# EAGLE schematic misko_3_board (EAGLE 8.1.1)
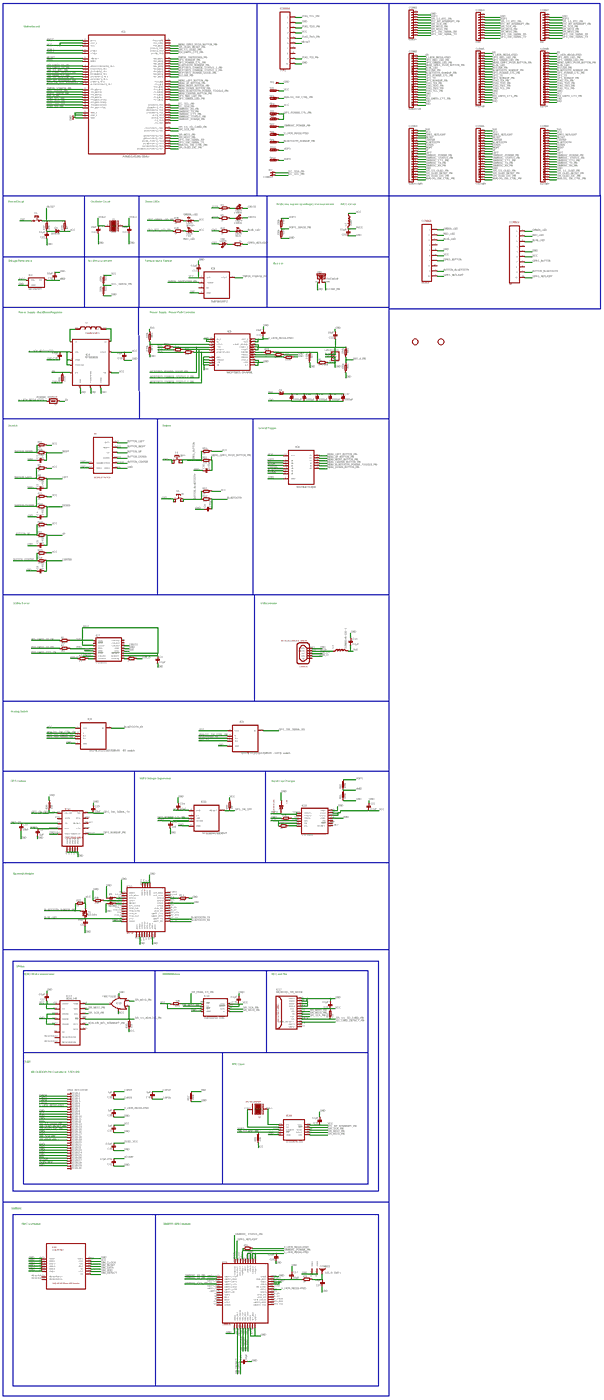
[diagram p0: schematic, sheet 1, overview]
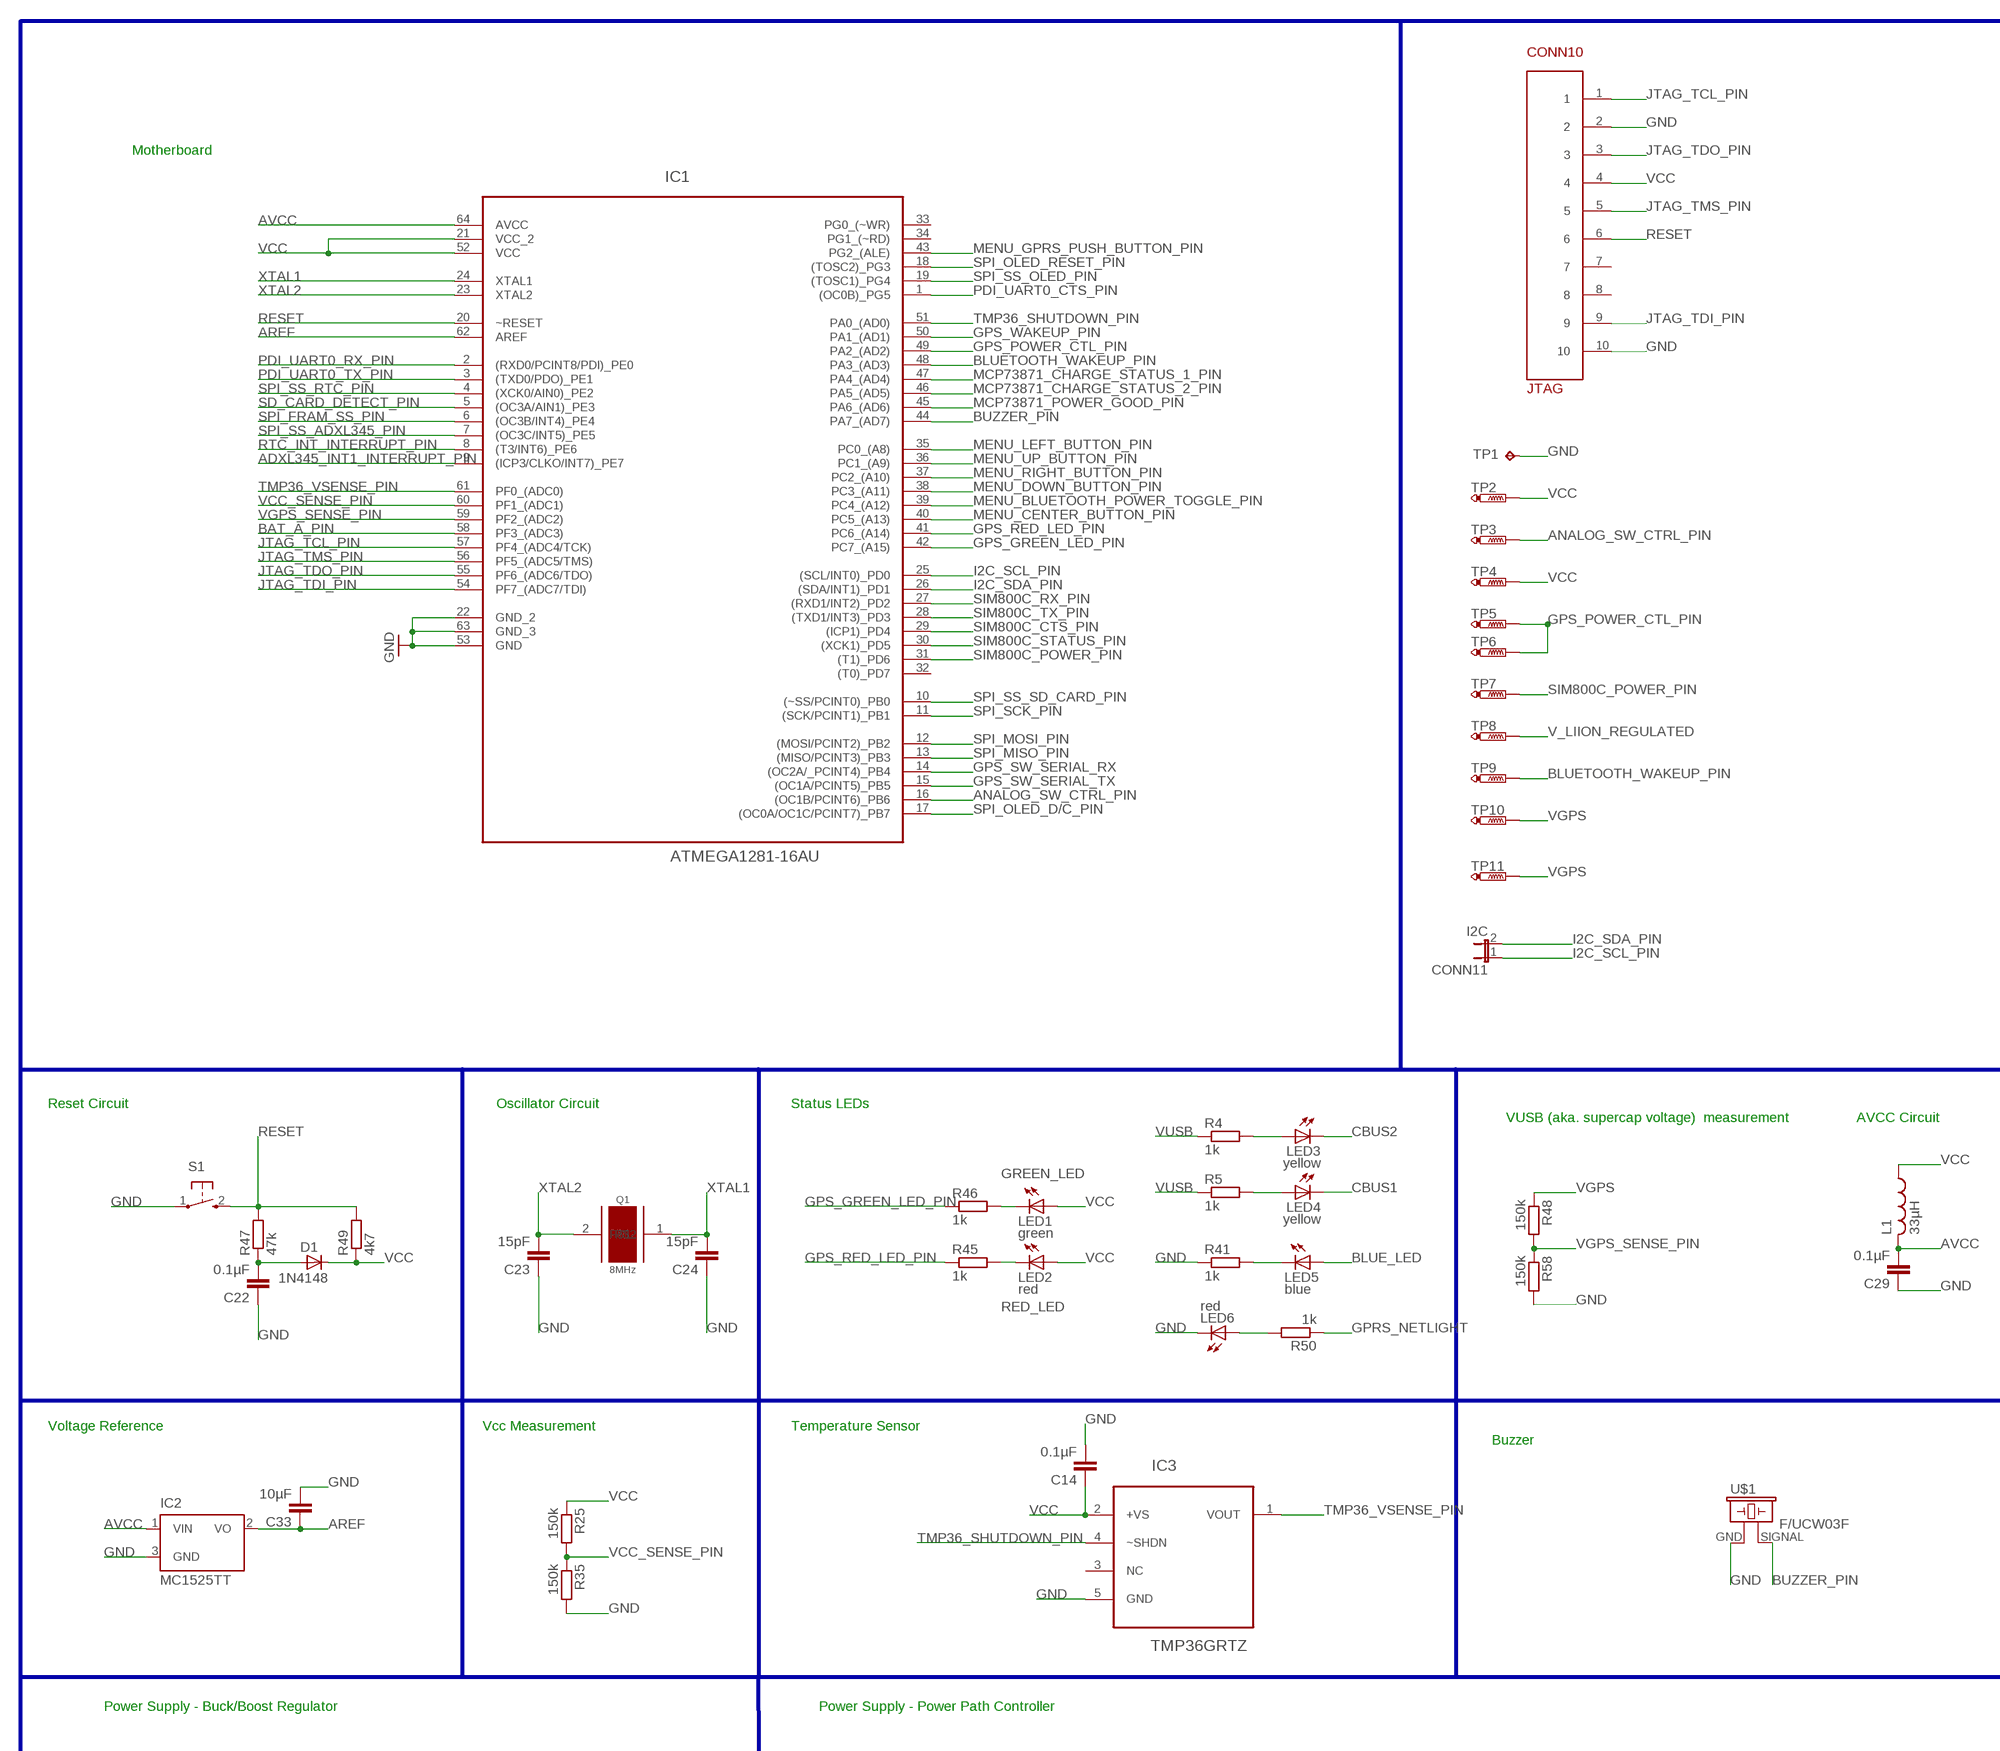
[diagram p1: schematic, sheet 1, part 1 of 5]
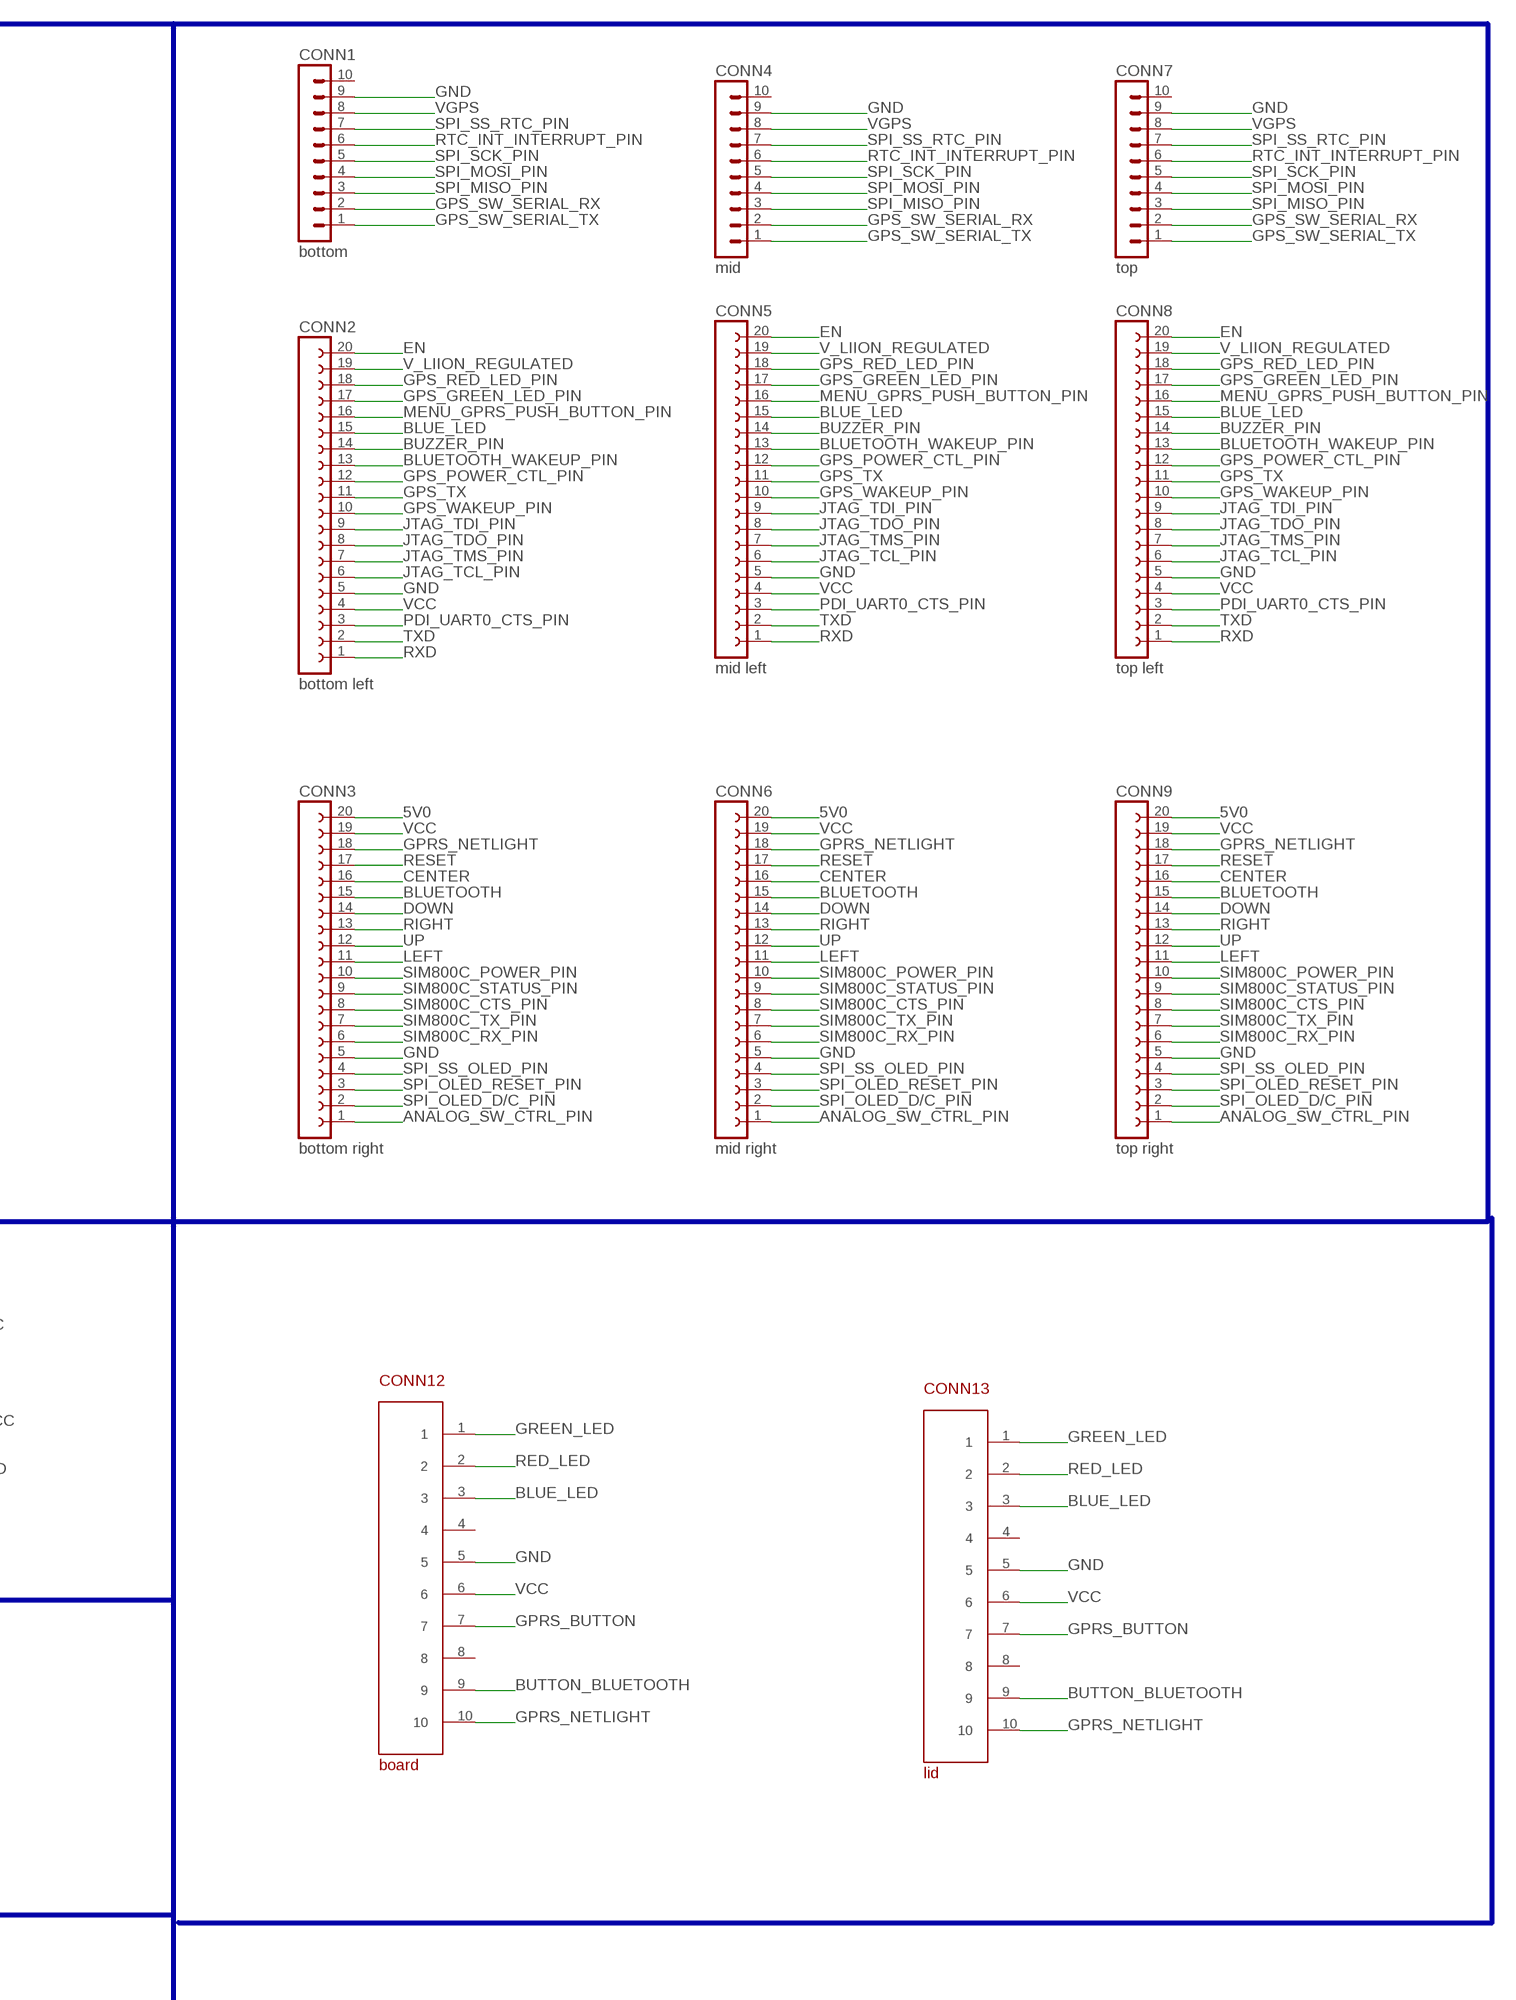
[diagram p2: schematic, sheet 1, part 2 of 5]
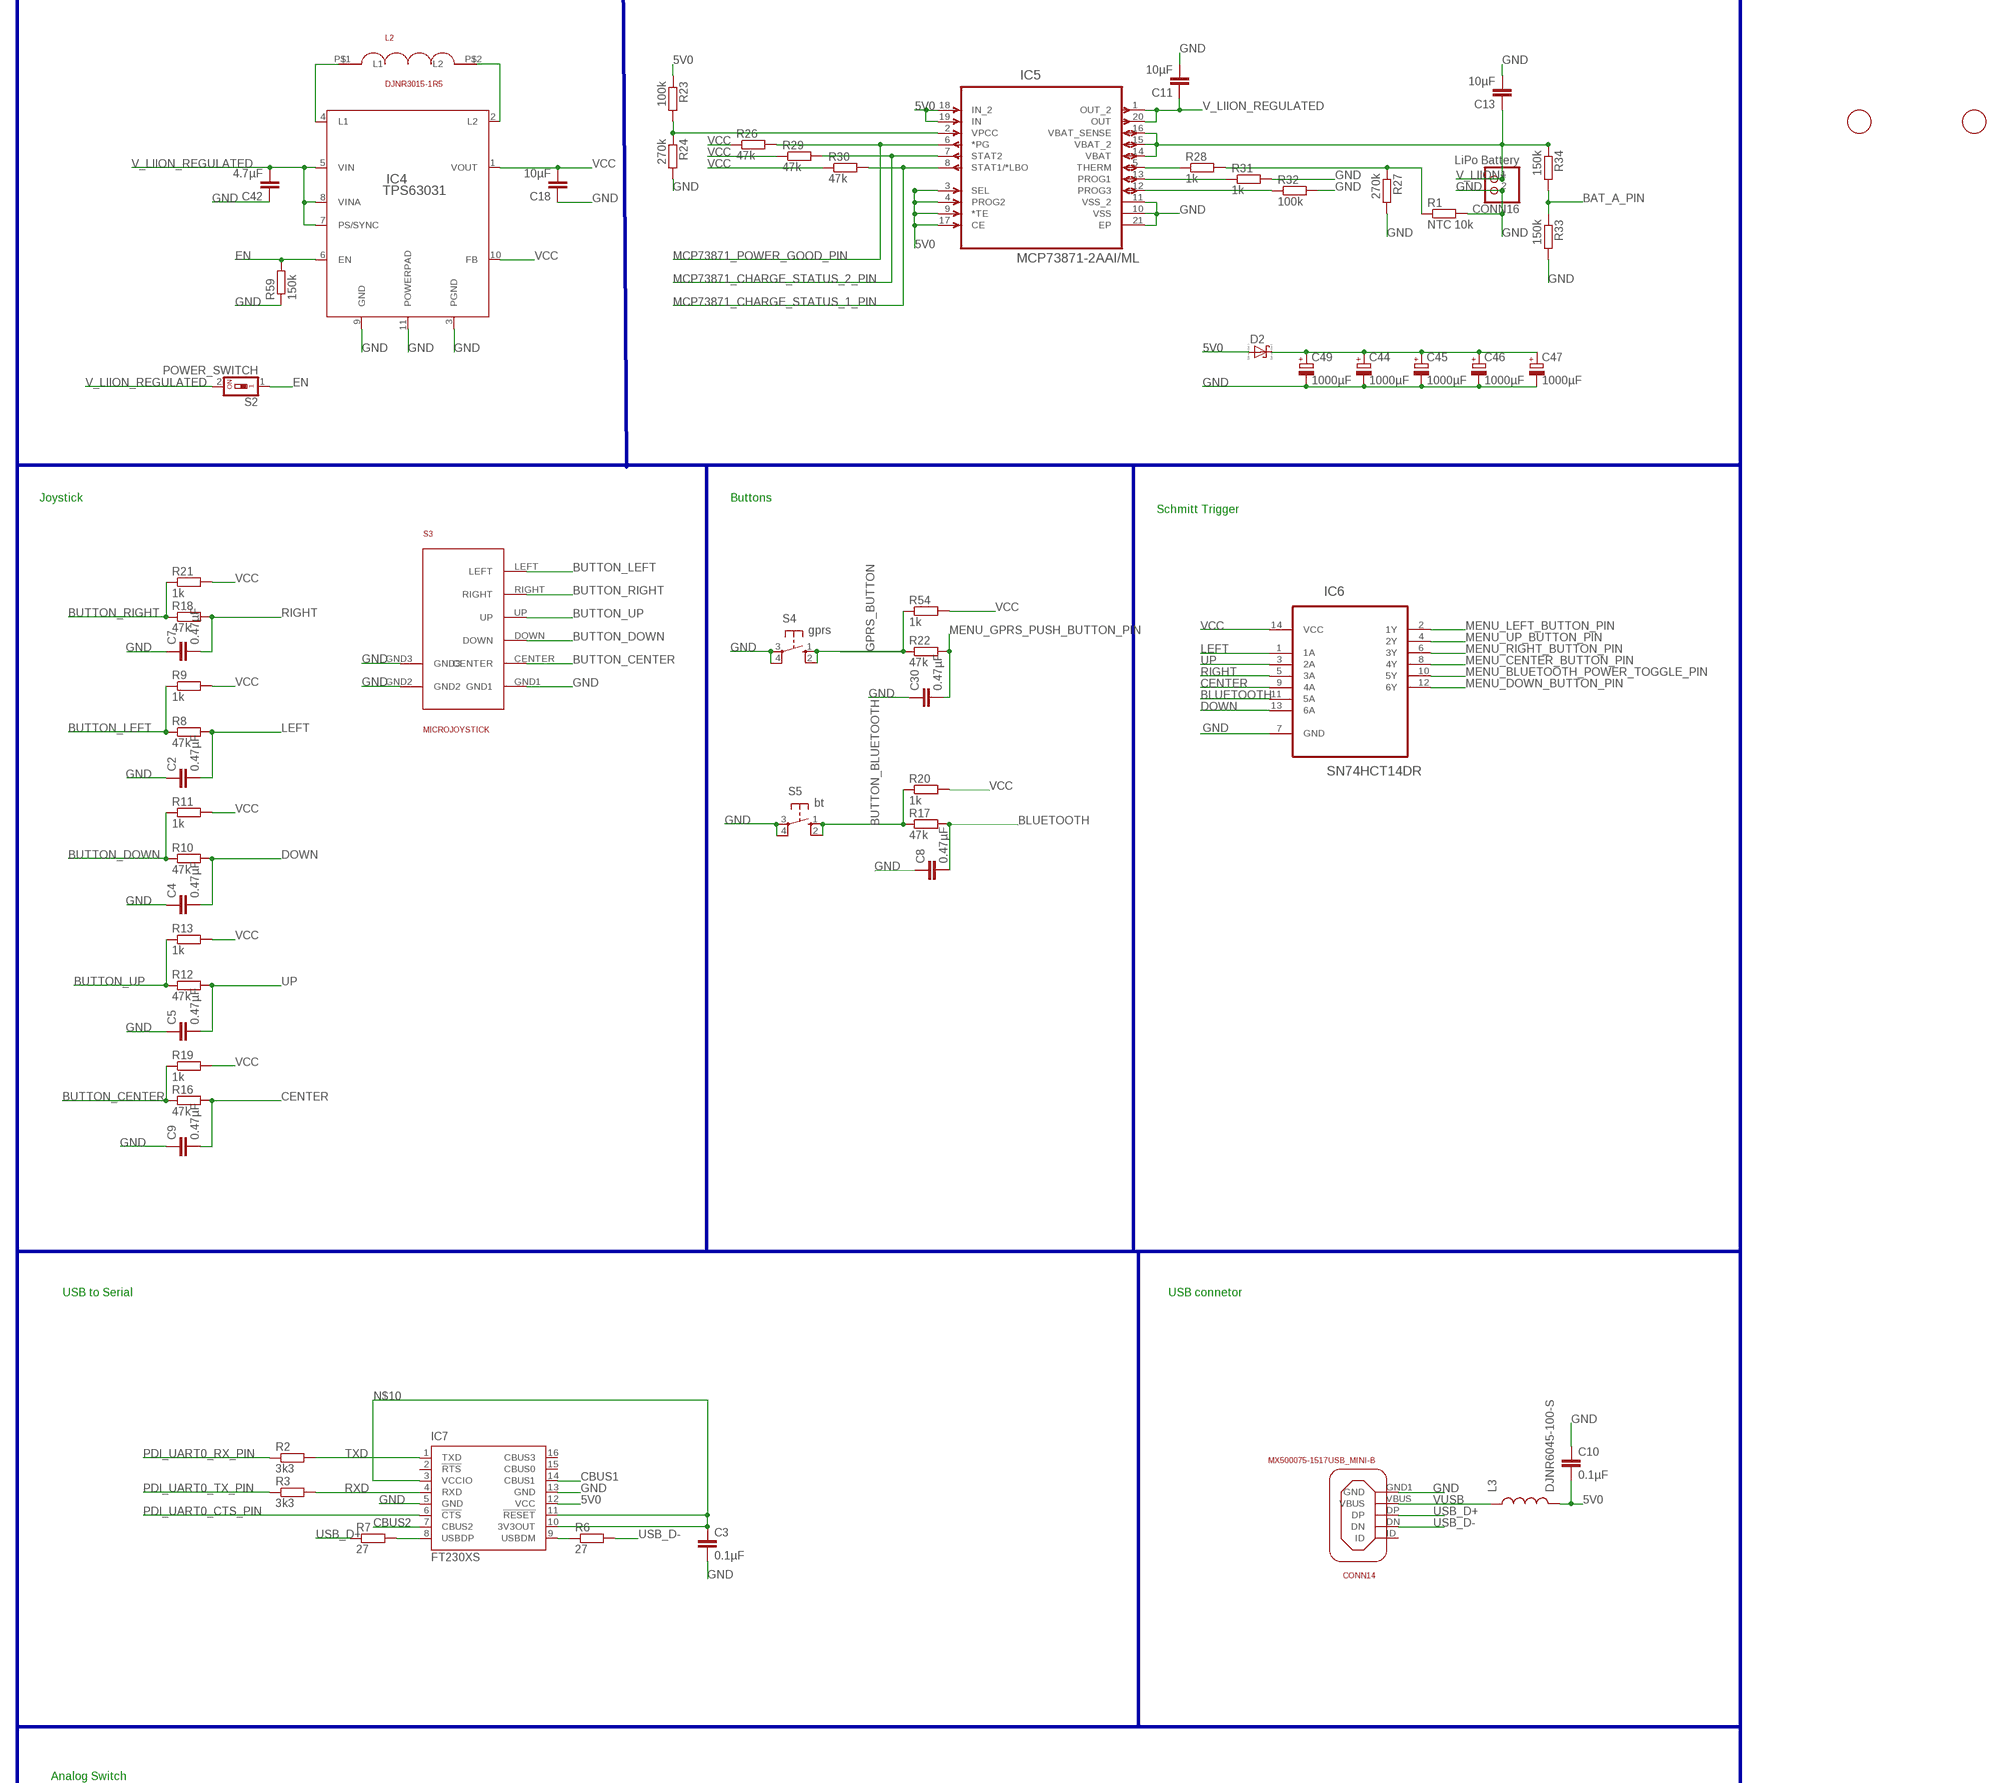
[diagram p3: schematic, sheet 1, part 3 of 5]
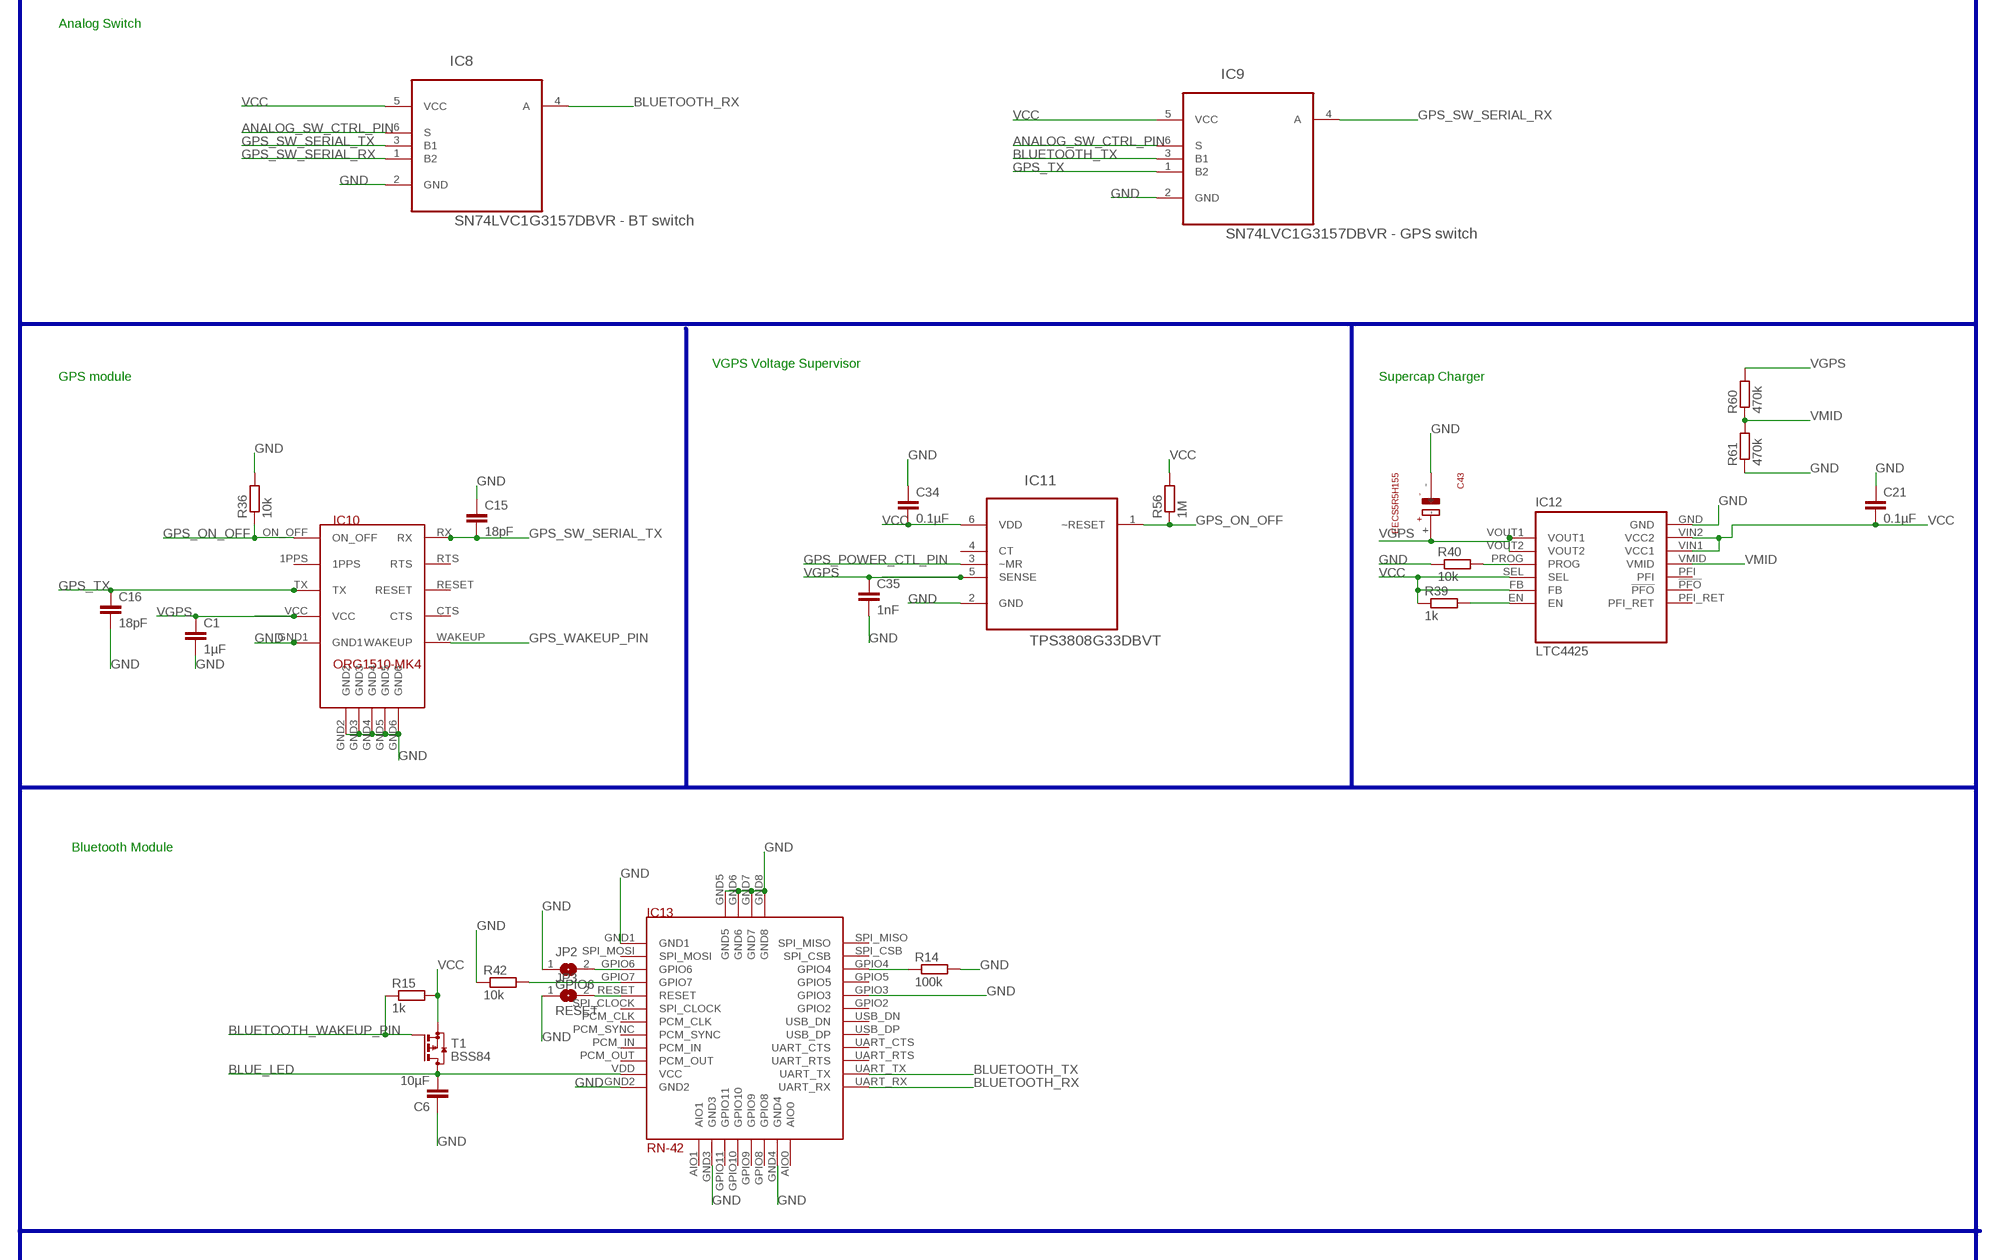
[diagram p4: schematic, sheet 1, part 4 of 5]
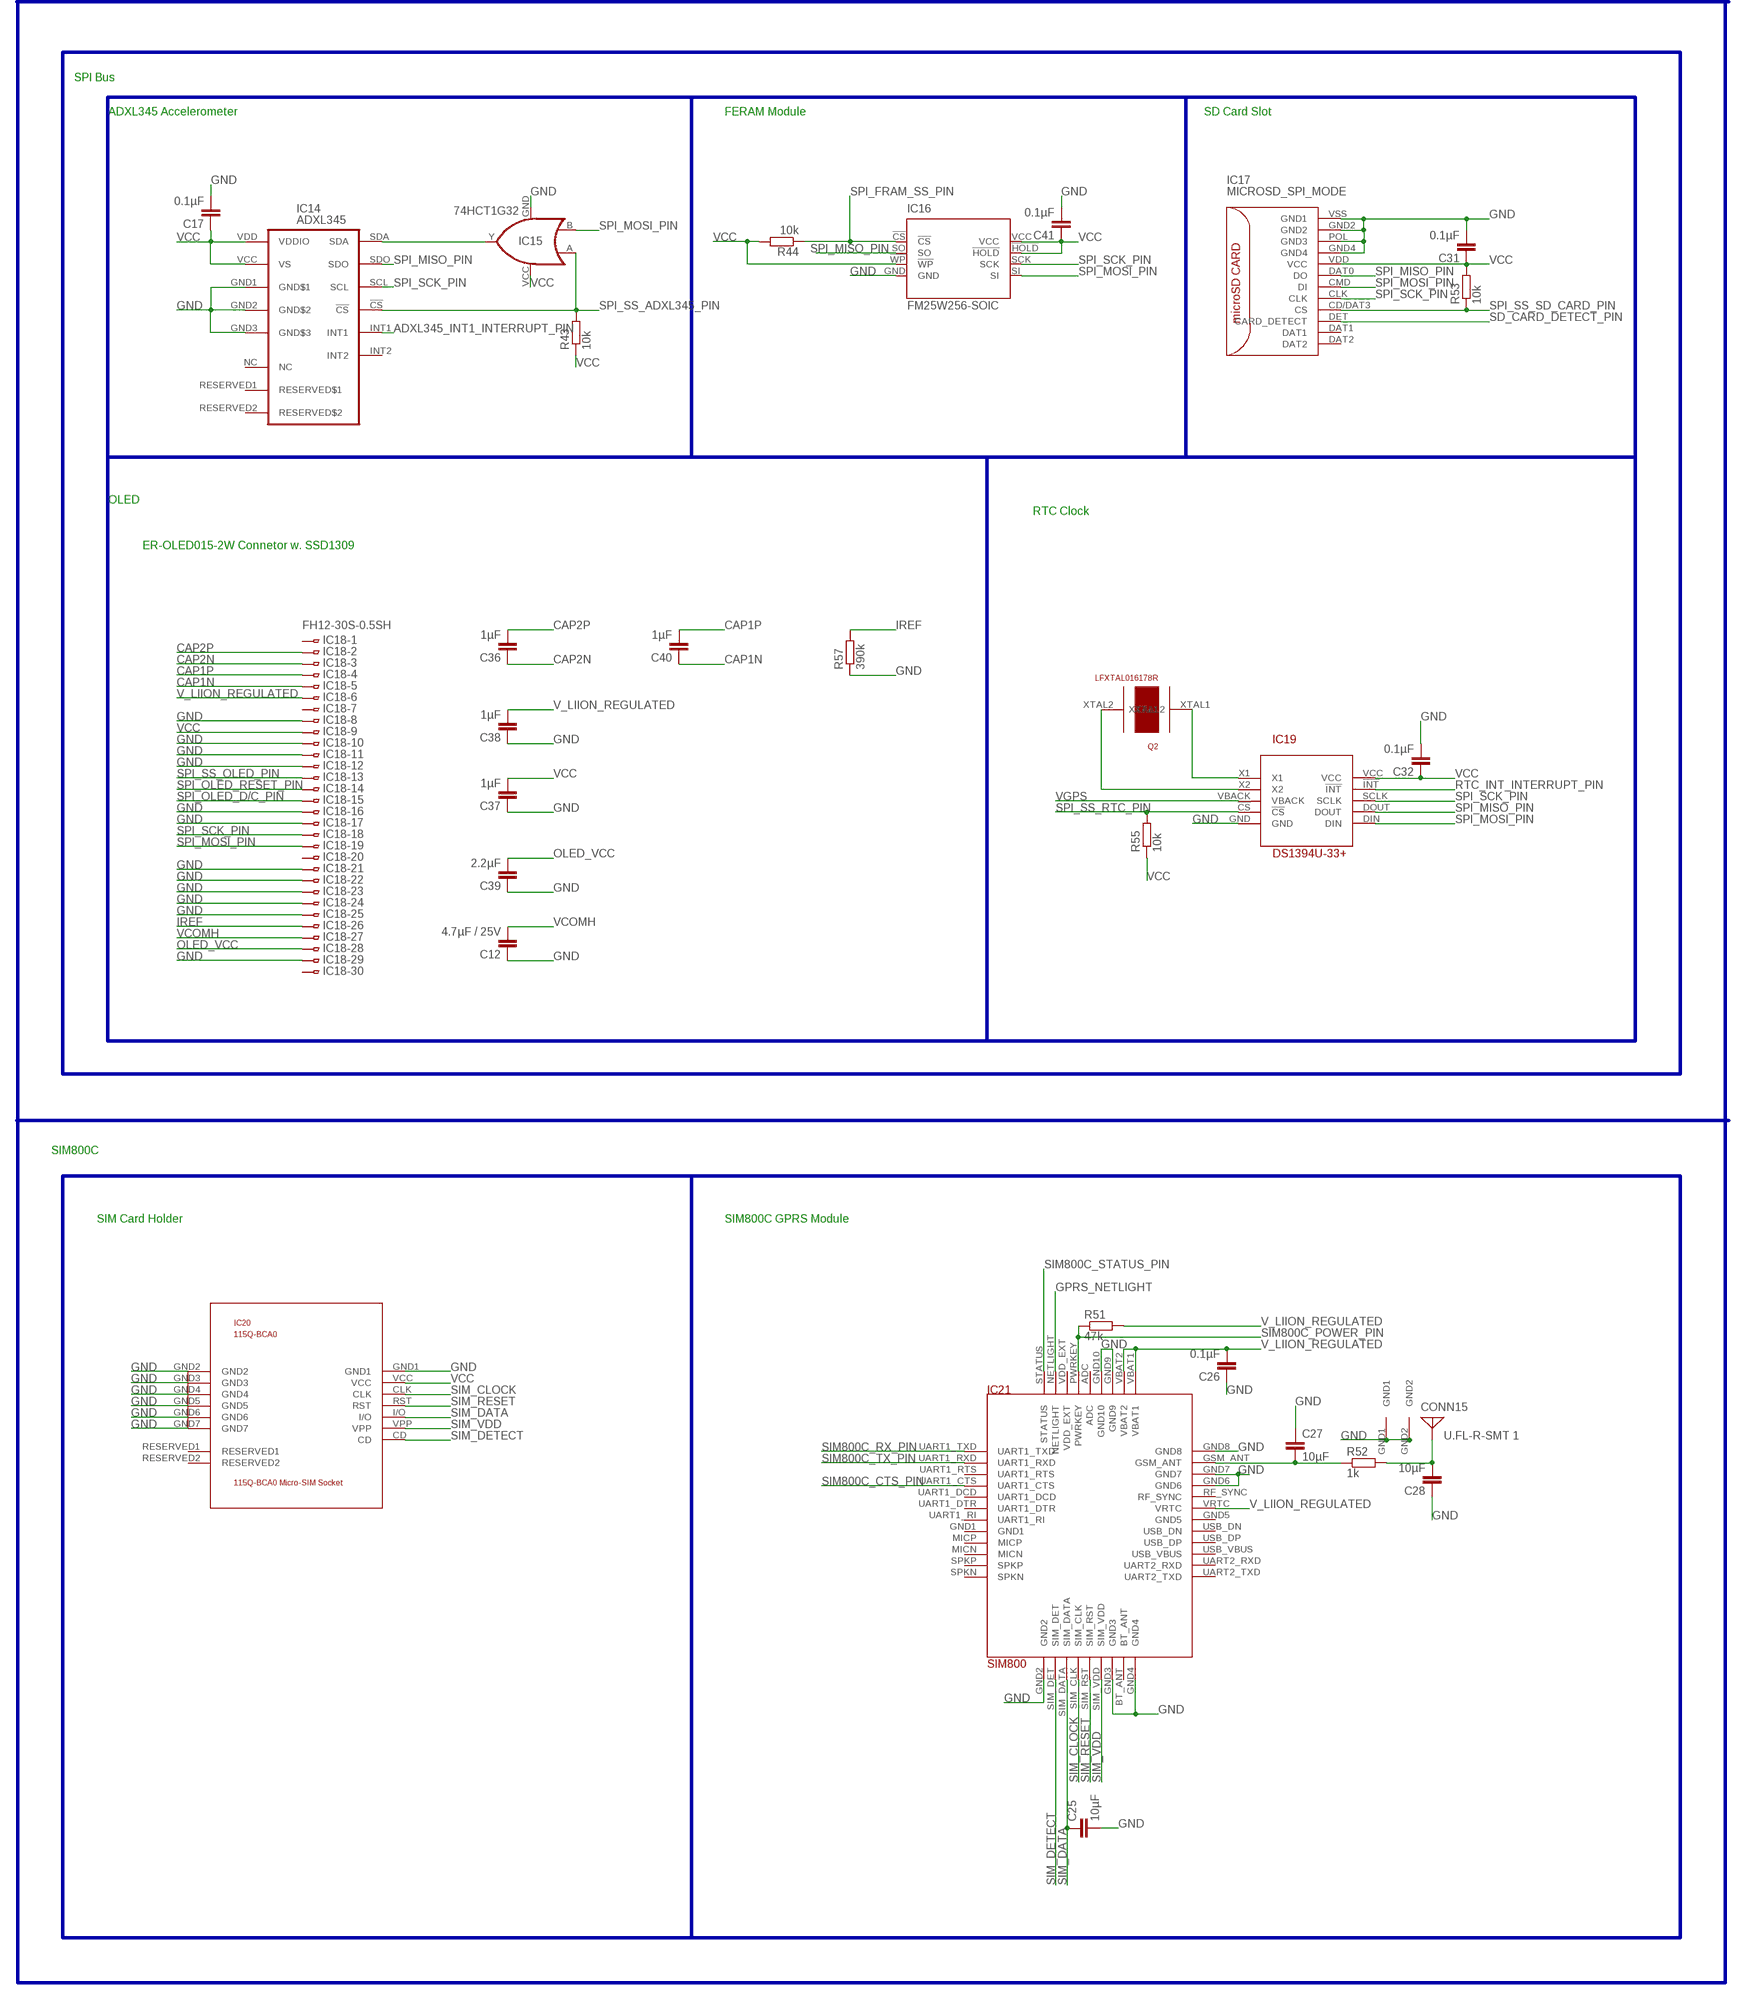
[diagram p5: schematic, sheet 1, part 5 of 5]

## Parts
C1  1µF  C-EUC0805  [C0805]
C2  0.47µF  C-EUC0805  [C0805]
C3  0.1µF  C-EUC0805  [C0805]
C4  0.47µF  C-EUC0805  [C0805]
C5  0.47µF  C-EUC0805  [C0805]
C6  10µF  C-EUC0805  [C0805]
C7  0.47µF  C-EUC0805  [C0805]
C8  0.47µF  C-EUC0805  [C0805]
C9  0.47µF  C-EUC0805  [C0805]
C10  0.1µF  C-EUC0805  [C0805]
C11  10µF  C-EUC0805  [C0805]
C12  4.7µF / 25V  C-EUC0805  [C0805]
C13  10µF  C-EUC0805  [C0805]
C14  0.1µF  C-EUC0805  [C0805]
C15  18pF  C-EUC0805  [C0805]
C16  18pF  C-EUC0805  [C0805]
C17  0.1µF  C-EUC0805  [C0805]
C18  10µF  C-EUC0805  [C0805]
C21  0.1µF  C-EUC0805  [C0805]
C22  0.1µF  C-EUC0805  [C0805]
C23  15pF  C-EUC0805  [C0805]
C24  15pF  C-EUC0805  [C0805]
C25  10µF  C-EUC0805  [C0805]
C26  0.1µF  C-EUC0805  [C0805]
C27  10µF  C-EUC0805  [C0805]
C28  10µF  C-EUC0805  [C0805]
C29  0.1µF  C-EUC0805  [C0805]
C30  0.47µF  C-EUC0805  [C0805]
C31  0.1µF  C-EUC0805  [C0805]
C32  0.1µF  C-EUC0805  [C0805]
C33  10µF  C-EUC0805  [C0805]
C34  0.1µF  C-EUC0805  [C0805]
C35  1nF  C-EUC0805  [C0805]
C36  1µF  C-EUC0805  [C0805]
C37  1µF  C-EUC0805  [C0805]
C38  1µF  C-EUC0805  [C0805]
C39  2.2µF  C-EUC0805  [C0805]
C40  1µF  C-EUC0805  [C0805]
C41  0.1µF  C-EUC0805  [C0805]
C42  4.7µF  C-EUC0805  [C0805]
C43  EECS5R5H155  [TH]
C44  1000µF  CPOL-EUE22-10AXIAL  [E22-10]
C45  1000µF  CPOL-EUE22-10AXIAL  [E22-10]
C46  1000µF  CPOL-EUE22-10AXIAL  [E22-10]
C47  1000µF  CPOL-EUE22-10AXIAL  [E22-10]
C49  1000µF  CPOL-EUE22-10AXIAL  [E22-10]
CONN1  bottom  MA10-1  [MA10-1]
CONN2  bottom left  FE20-1  [FE20]
CONN3  bottom right  FE20-1  [FE20]
CONN4  mid  MA10-1  [MA10-1]
CONN5  mid left  FE20-1  [FE20]
CONN6  mid right  FE20-1  [FE20]
CONN7  top  MA10-1  [MA10-1]
CONN8  top left  FE20-1  [FE20]
CONN9  top right  FE20-1  [FE20]
CONN10  JTAG  1.27-10-PIN-HEADER  [TH]
CONN11  I2C  JP1E  [JP1]
CONN12  board  1.27-10-PIN-HEADER  [TH]
CONN13  lid  1.27-10-PIN-HEADER  [TH]
CONN14  MX500075-1517USB_MINI-B  [TH]
CONN15  U.FL-R-SMT 1  ANTENNASMD  [SMD]
CONN16  LiPo Battery  JST_2PIN-THM-RA  [JST-PH-2-THM-RA]
D1  1N4148  [D0805]
D2  SCHOTTKY-DIODEF126Z12  [DIODE_F126Z12]
FI1  FIDUCIAL  [FIDUCIAL_1MM]
FI2  FIDUCIAL  [FIDUCIAL_1MM]
IC1  ATMEGA1281-16AU  [QFP80P1600X1600X120-64N]
IC2  MC1525TT  [SOT23]
IC3  TMP36GRTZ  TMP36GRTZ-REEL7  [SOT95P280X145-5N]
IC4  TPS63031  TPS63001DRCR  [NEWPVSON-N10]
IC5  MCP73871-2AAI/ML  [QFN50P400X400X100-21N]
IC6  SN74HCT14DR  [SOIC127P600X175-14N]
IC7  FT230XS  [SSOP16]
IC8  SN74LVC1G3157DBVR - BT switch  SN74LVC1G3157DBVR  [SOT95P280X145-6N]
IC9  SN74LVC1G3157DBVR - GPS switch  SN74LVC1G3157DBVR  [SOT95P280X145-6N]
IC10  ORG1510-MK4  [PACKAGE]
IC11  TPS3808G33DBVT  [SOT95P280X145-6N]
IC12  LTC4425  [MSOP]
IC13  RN-42  [RN-42]
IC14  ADXL345  [LGA14]
IC15  74HCT1G32  74HCT1G32GW-DC  [SOT353/5]
IC16  FM25W256-SOIC  [SOIC08]
IC17  MICROSD_SPI_MODE  [MICRO_SD_CONNECTOR]
IC18  FH12-30S-0.5SH  [FH12-30S-0.5SH]
IC19  DS1394U-33+  [10UMAX]
IC20  115Q-BCA0  [115Q-BCA0]
IC21  SIM800  [SIM800C]
JP2  GPIO6  SJW  [SJW]
JP3  RESET  SJW  [SJW]
L1  33µH  L-US  [L0805]
L2  DJNR3015-1R5  [FFF]
L3  DJNR6045-100-S  [DJNR6045-100-S]
LED1  green  LEDSQR2X5  [LED2X5]
LED2  red  LEDSQR2X5  [LED2X5]
LED3  yellow  LEDCHIPLED_1206  [CHIPLED_1206]
LED4  yellow  LEDCHIPLED_1206  [CHIPLED_1206]
LED5  blue  LEDSQR2X5  [LED2X5]
LED6  red  LEDSQR2X5  [LED2X5]
Q1  8MHz  OSCILATOR  [QS]
Q2  LFXTAL016178R  [SMD]
R1  NTC 10k  R-EU_0204/5  [0204/5]
R2  3k3  R-EU_R0805  [R0805]
R3  3k3  R-EU_R0805  [R0805]
R4  1k  R-EU_R0805  [R0805]
R5  1k  R-EU_R0805  [R0805]
R6  27  R-EU_R0805  [R0805]
R7  27  R-EU_R0805  [R0805]
R8  47k  R-EU_R0805  [R0805]
R9  1k  R-EU_R0805  [R0805]
R10  47k  R-EU_R0805  [R0805]
R11  1k  R-EU_R0805  [R0805]
R12  47k  R-EU_R0805  [R0805]
R13  1k  R-EU_R0805  [R0805]
R14  100k  R-EU_R0805  [R0805]
R15  1k  R-EU_R0805  [R0805]
R16  47k  R-EU_R0805  [R0805]
R17  47k  R-EU_R0805  [R0805]
R18  47k  R-EU_R0805  [R0805]
R19  1k  R-EU_R0805  [R0805]
R20  1k  R-EU_R0805  [R0805]
R21  1k  R-EU_R0805  [R0805]
R22  47k  R-EU_R0805  [R0805]
R23  100k  R-EU_R0805  [R0805]
R24  270k  R-EU_R0805  [R0805]
R25  150k  R-EU_R0805  [R0805]
R26  47k  R-EU_R0805  [R0805]
R27  270k  R-EU_R0805  [R0805]
R28  1k  R-EU_R0805  [R0805]
R29  47k  R-EU_R0805  [R0805]
R30  47k  R-EU_R0805  [R0805]
R31  1k  R-EU_R0805  [R0805]
R32  100k  R-EU_R0805  [R0805]
R33  150k  R-EU_R0805  [R0805]
R34  150k  R-EU_R0805  [R0805]
R35  150k  R-EU_R0805  [R0805]
R36  10k  R-EU_R0805  [R0805]
R39  1k  R-EU_R0805  [R0805]
R40  10k  R-EU_R0805  [R0805]
R41  1k  R-EU_R0805  [R0805]
R42  10k  R-EU_R0805  [R0805]
R43  10k  R-EU_R0805  [R0805]
R44  10k  R-EU_R0805  [R0805]
R45  1k  R-EU_R0805  [R0805]
R46  1k  R-EU_R0805  [R0805]
R47  47k  R-EU_R0805  [R0805]
R48  150k  R-EU_R0805  [R0805]
R49  4k7  R-EU_R0805  [R0805]
R50  1k  R-EU_R0805  [R0805]
R51  47k  R-EU_R0805  [R0805]
R52  1k  R-EU_R0805  [R0805]
R53  10k  R-EU_R0805  [R0805]
R54  1k  R-EU_R0805  [R0805]
R55  10k  R-EU_R0805  [R0805]
R56  1M  R-EU_R0805  [R0805]
R57  390k  R-EU_R0805  [R0805]
R58  150k  R-EU_R0805  [R0805]
R59  150k  R-EU_R0805  [R0805]
R60  470k  R-EU_R0805  [R0805]
R61  470k  R-EU_R0805  [R0805]
S1  DTSM-32N-B  [DTSM-32N-B]
S2  POWER_SWITCH  SWS001  [SMS-001]
S3  MICROJOYSTICK  [MICROJOYSTICK]
S4  gprs  10-XX  [B3F-10XX]
S5  bt  10-XX  [B3F-10XX]
T1  BSS84  [SOT23]
TP1  GND  TPPAD1-17Y  [P1-17Y]
TP2  VCC  PTR1TP14R  [TP14R]
TP3  Analogue Switch CRTL Pin  PTR1TP14R  [TP14R]
TP4  VCC  PTR1TP14R  [TP14R]
TP5  GPS Power CTRL Pin  PTR1B1,27  [B1,27]
TP6  GPS Power CTRL Pin  PTR1B1,27  [B1,27]
TP7  SIM800 Power CTRL Pin  PTR1B1,27  [B1,27]
TP8  VLiIon Regulated  PTR1TP14R  [TP14R]
TP9  Bluetooth Wakeup Pin  PTR1TP14R  [TP14R]
TP10  VGPS  PTR1TP14R  [TP14R]
TP11  VGPS  PTR1TP14R  [TP14R]
U$1  F/UCW03F  [F/UCW03LF]

## Nets
5V0 [VCC]: C10.2 CONN3.20 CONN6.20 CONN9.20 D2.A(C) IC5.3(SEL) IC5.4(PROG2) IC5.9(*TE) IC5.17(CE) IC5.18(IN_2) IC5.19(IN) IC7.12(VCC) L3.P$2 R23.1
ADXL345_INT1_INTERRUPT_PIN [signal]: IC1.9((ICP3/CLKO/INT7)_PE7) IC14.INT1
ADXL345SDA [signal]: IC14.SDA IC15.Y
ANALOG_SW_CTRL_PIN [signal cross-board]: CONN3.1 CONN6.1 CONN9.1 IC1.16((OC1B/PCINT6)_PB6) IC8.6(S) IC9.6(S) TP3.TP
ANTENNA [signal]: C28.2 CONN15.SIGNAL(ANT) R52.2
AREF [signal]: C33.1 IC1.62(AREF) IC2.2(VO)
AVCC [signal]: C29.2 IC1.64(AVCC) IC2.1(VIN) L1.2
BAT_A_PIN [signal]: IC1.58(PF3_(ADC3)) R33.1 R34.2
BLUE_LED [signal cross-board]: C6.2 CONN2.15 CONN5.15 CONN8.15 CONN12.3 CONN13.3 IC13.VDD(VCC) LED5.A T1.3(D)
BLUETOOTH [signal cross-board]: C8.2 CONN3.15 CONN6.15 CONN9.15 IC6.11(5A) R17.2
BLUETOOTH_RX [signal]: IC8.4(A) IC13.UART_RX
BLUETOOTH_TX [signal]: IC9.3(B1) IC13.UART_TX
BLUETOOTH_WAKEUP_PIN [signal cross-board]: CONN2.13 CONN5.13 CONN8.13 IC1.48(PA3_(AD3)) R15.1 T1.1(G) TP9.TP
BT_GPIO6 [signal]: IC13.GPIO6 JP2.2
BT_LED [signal]: LED5.K(C) R41.2
BT_RST [signal]: IC13.RESET JP3.2
BUTTON_BLUETOOTH [signal cross-board]: CONN12.9 CONN13.9 R17.1 R20.1 S5.1(S) S5.2(S1)
BUTTON_CENTER [signal]: R16.1 R19.1 S3.CENTER
BUTTON_DOWN [signal]: R10.1 R11.1 S3.DOWN
BUTTON_LEFT [signal]: R8.1 R9.1 S3.LEFT
BUTTON_RIGHT [signal]: R18.1 R21.1 S3.RIGHT
BUTTON_UP [signal]: R12.1 R13.1 S3.UP
BUZZER_PIN [signal cross-board]: CONN2.14 CONN5.14 CONN8.14 IC1.44(PA7_(AD7)) U$1.SIGNAL
CAP1N [signal]: C40.1 IC18.5
CAP1P [signal]: C40.2 IC18.4
CAP2N [signal]: C36.1 IC18.3
CAP2P [signal]: C36.2 IC18.2
CBUS1 [signal]: IC7.14(CBUS1) LED4.C
CBUS2 [signal]: IC7.7(CBUS2) LED3.C
CENTER [signal cross-board]: C9.2 CONN3.16 CONN6.16 CONN9.16 IC6.9(4A) R16.2
DOWN [signal cross-board]: C4.2 CONN3.14 CONN6.14 CONN9.14 IC6.13(6A) R10.2
EN [signal cross-board]: CONN2.20 CONN5.20 CONN8.20 IC4.6(EN) R59.2 S2.1
GND: C1.2 C2.1 C3.2 C4.1 C5.1 C6.1 C7.1 C8.1 C9.1 C10.1 C11.2 C12.1 C13.2 C14.2 C15.1 C16.2 C17.2 C18.1 C21.1 C22.1 C23.1 C24.1 C25.2 C26.1 C27.1 C28.1 C29.1 C30.1 C31.2 C32.2 C33.2 C34.1 C35.2 C37.1 C38.1 C39.1 C41.2 C42.1 C43.- C44.- C45.- C46.- C47.- C49.- CONN1.9 CONN2.5 CONN3.5 CONN4.9 CONN5.5 CONN6.5 CONN7.9 CONN8.5 CONN9.5 CONN10.2 CONN10.10 CONN12.5 CONN13.5 CONN14.GND1(GND) CONN15.GND1 CONN15.GND2 CONN16.2 IC1.22(GND_2) IC1.53(GND) IC1.63(GND_3) IC2.3(GND) IC3.5(GND) IC4.3(PGND) IC4.9(GND) IC4.11(POWERPAD) IC5.10(VSS) IC5.11(VSS_2) IC5.21(EP) IC6.7(GND) IC7.5(GND) IC7.13(GND) IC8.2(GND) IC9.2(GND) IC10.GND1 IC10.GND2 IC10.GND3 IC10.GND4 IC10.GND5 IC10.GND6 IC11.2(GND) IC12.GND IC13.GND1 IC13.GND2 IC13.GND3 IC13.GND4 IC13.GND5 IC13.GND6 IC13.GND7 IC13.GND8 IC13.GPIO3 IC14.GND1(GND$1) IC14.GND2(GND$2) IC14.GND3(GND$3) IC15.GND IC16.GND IC17.GND2 IC17.GND4 IC17.POL(GND3) IC17.VSS(GND1) IC18.8 IC18.10 IC18.11 IC18.12 IC18.16 IC18.17 IC18.21 IC18.22 IC18.23 IC18.24 IC18.25 IC18.29 IC19.GND IC20.GND1 IC20.GND2 IC20.GND3 IC20.GND4 IC20.GND5 IC20.GND6 IC20.GND7 IC21.GND2 IC21.GND3 IC21.GND4 IC21.GND6 IC21.GND7 IC21.GND8 IC21.GND9 IC21.GND10 JP2.1 JP3.1 LED6.K(C) R1.2 R14.2 R24.2 R27.2 R31.2 R32.2 R33.2 R35.2 R36.2 R40.1 R41.1 R42.1 R57.1 R58.2 R59.1 R61.1 S1.1 S3.GND1 S3.GND2 S3.GND3 S4.3(P) S4.4(P1) S5.3(P) S5.4(P1) TP1.TP U$1.GND
GPIO4 [signal]: IC13.GPIO4 R14.1
GPIO7 [signal]: IC13.GPIO7 R42.2
GPRS_BUTTON [signal cross-board]: CONN12.7 CONN13.7 R22.1 R54.1 S4.1(S) S4.2(S1)
GPRS_LED [signal]: LED6.A R50.2
GPRS_NETLIGHT [signal cross-board]: CONN3.18 CONN6.18 CONN9.18 CONN12.10 CONN13.10 IC21.NETLIGHT R50.1
GPS_GREEN_LED_PIN [signal cross-board]: CONN2.17 CONN5.17 CONN8.17 IC1.42(PC7_(A15)) R46.1
GPS_ON_OFF [signal cross-board]: IC10.ON_OFF IC11.1(~RESET) R36.1 R56.1
GPS_POWER_CTL_PIN [signal]: CONN2.12 CONN5.12 CONN8.12 IC1.49(PA2_(AD2)) IC11.3(~MR) TP5.TP TP6.TP
GPS_RED_LED_PIN [signal cross-board]: CONN2.18 CONN5.18 CONN8.18 IC1.41(PC6_(A14)) R45.1
GPS_SW_SERIAL_RX [signal cross-board]: CONN1.2 CONN4.2 CONN7.2 IC1.14((OC2A/_PCINT4)_PB4) IC8.1(B2) IC9.4(A)
GPS_SW_SERIAL_TX [signal cross-board]: C15.2 CONN1.1 CONN4.1 CONN7.1 IC1.15((OC1A/PCINT5)_PB5) IC8.3(B1) IC10.RX
GPS_TX [signal cross-board]: C16.1 CONN2.11 CONN5.11 CONN8.11 IC9.1(B2) IC10.TX
GPS_WAKEUP_PIN [signal cross-board]: CONN2.10 CONN5.10 CONN8.10 IC1.50(PA1_(AD1)) IC10.WAKEUP
GREEN_LED [signal cross-board]: CONN12.1 CONN13.1 LED1.K(C) R46.2
GSM_ANT [signal]: C27.2 IC21.GSM_ANT R52.1
I2C_SCL_PIN [signal]: CONN11.1 IC1.25((SCL/INT0)_PD0)
I2C_SDA_PIN [signal]: CONN11.2 IC1.26((SDA/INT1)_PD1)
IREF [signal]: IC18.26 R57.2
JTAG_TCL_PIN [signal cross-board]: CONN2.6 CONN5.6 CONN8.6 CONN10.1 IC1.57(PF4_(ADC4/TCK))
JTAG_TDI_PIN [signal cross-board]: CONN2.9 CONN5.9 CONN8.9 CONN10.9 IC1.54(PF7_(ADC7/TDI))
JTAG_TDO_PIN [signal cross-board]: CONN2.8 CONN5.8 CONN8.8 CONN10.3 IC1.55(PF6_(ADC6/TDO))
JTAG_TMS_PIN [signal cross-board]: CONN2.7 CONN5.7 CONN8.7 CONN10.5 IC1.56(PF5_(ADC5/TMS))
L1 [signal]: IC4.4(L1) L2.P$1(L1)
L2 [signal]: IC4.2(L2) L2.P$2(L2)
LEFT [signal cross-board]: C2.2 CONN3.11 CONN6.11 CONN9.11 IC6.1(1A) R8.2
LTC4425_EN [signal]: IC12.EN R39.2
LTC4425_PROG [signal]: IC12.PROG R40.2
MCP73871_CHARGE_STATUS_1_PIN [signal]: IC1.47(PA4_(AD4)) IC5.8(STAT1/*LBO) R30.2
MCP73871_CHARGE_STATUS_2_PIN [signal]: IC1.46(PA5_(AD5)) IC5.7(STAT2) R29.2
MCP73871_POWER_GOOD_PIN [signal]: IC1.45(PA6_(AD6)) IC5.6(*PG) R26.2
MENU_BLUETOOTH_POWER_TOGGLE_PIN [signal]: IC1.39(PC4_(A12)) IC6.10(5Y)
MENU_CENTER_BUTTON_PIN [signal]: IC1.40(PC5_(A13)) IC6.8(4Y)
MENU_DOWN_BUTTON_PIN [signal]: IC1.38(PC3_(A11)) IC6.12(6Y)
MENU_GPRS_PUSH_BUTTON_PIN [signal cross-board]: C30.2 CONN2.16 CONN5.16 CONN8.16 IC1.43(PG2_(ALE)) R22.2
MENU_LEFT_BUTTON_PIN [signal]: IC1.35(PC0_(A8)) IC6.2(1Y)
MENU_RIGHT_BUTTON_PIN [signal]: IC1.37(PC2_(A10)) IC6.6(3Y)
MENU_UP_BUTTON_PIN [signal]: IC1.36(PC1_(A9)) IC6.4(2Y)
N$6: C44.+ C45.+ C46.+ C47.+ C49.+ D2.C(A)
N$10 [signal]: C3.1 IC7.3(VCCIO) IC7.10(3V3OUT) IC7.11(!RESET)
N$19 [signal]: R1.1 R27.1 R28.2
N$31 [signal]: C22.2 D1.A R47.1
OLED_VCC [signal]: C39.2 IC18.28
PDI_UART0_CTS_PIN [signal cross-board]: CONN2.3 CONN5.3 CONN8.3 IC1.1((OC0B)_PG5) IC7.6(!CTS)
PDI_UART0_RX_PIN [signal cross-board]: IC1.2((RXD0/PCINT8/PDI)_PE0) R2.1
PDI_UART0_TX_PIN [signal cross-board]: IC1.3((TXD0/PDO)_PE1) R3.1
PROG1 [signal]: IC5.13(PROG1) R31.1
PROG3 [signal]: IC5.12(PROG3) R32.1
RED_LED [signal cross-board]: CONN12.2 CONN13.2 LED2.K(C) R45.2
RESET [signal cross-board]: CONN3.17 CONN6.17 CONN9.17 CONN10.6 IC1.20(~RESET) R47.2 R49.2 S1.2
RIGHT [signal cross-board]: C7.2 CONN3.13 CONN6.13 CONN9.13 IC6.5(3A) R18.2
RTC_INT_INTERRUPT_PIN [signal cross-board]: CONN1.6 CONN4.6 CONN7.6 IC1.8((T3/INT6)_PE6) IC19.!INT!
RTC_XTAL1 [signal]: IC19.X1 Q2.XTAL1
RTC_XTAL2 [signal]: IC19.X2 Q2.XTAL2
RXD [signal cross-board]: CONN2.1 CONN5.1 CONN8.1 IC7.4(RXD) R3.2
SD_CARD_DETECT_PIN [signal]: IC1.5((OC3A/AIN1)_PE3) IC17.DET(CARD_DETECT)
SIM800C_CTS_PIN [signal cross-board]: CONN3.8 CONN6.8 CONN9.8 IC1.29((ICP1)_PD4) IC21.UART1_CTS
SIM800C_POWER_PIN [signal cross-board]: CONN3.10 CONN6.10 CONN9.10 IC1.31((T1)_PD6) IC21.PWRKEY R51.1 TP7.TP
SIM800C_RX_PIN [signal cross-board]: CONN3.6 CONN6.6 CONN9.6 IC1.27((RXD1/INT2)_PD2) IC21.UART1_TXD
SIM800C_STATUS_PIN [signal cross-board]: CONN3.9 CONN6.9 CONN9.9 IC1.30((XCK1)_PD5) IC21.STATUS
SIM800C_TX_PIN [signal cross-board]: CONN3.7 CONN6.7 CONN9.7 IC1.28((TXD1/INT3)_PD3) IC21.UART1_RXD
SIM_CLOCK [signal]: IC20.CLK IC21.SIM_CLK
SIM_DATA [signal]: C25.1 IC20.I/O IC21.SIM_DATA
SIM_DETECT [signal]: IC20.CD IC21.SIM_DET
SIM_RESET [signal]: IC20.RST IC21.SIM_RST
SIM_VDD [signal]: IC20.VPP IC21.SIM_VDD
SPI_FRAM_SS_PIN [signal]: IC1.6((OC3B/INT4)_PE4) IC16.!CS! R44.1
SPI_MISO_PIN [signal cross-board]: CONN1.3 CONN4.3 CONN7.3 IC1.13((MISO/PCINT3)_PB3) IC14.SDO IC16.SO IC17.DAT0(DO) IC19.DOUT
SPI_MOSI_PIN [signal cross-board]: CONN1.4 CONN4.4 CONN7.4 IC1.12((MOSI/PCINT2)_PB2) IC15.B IC16.SI IC17.CMD(DI) IC18.19 IC19.DIN
SPI_OLED_D/C_PIN [signal cross-board]: CONN3.2 CONN6.2 CONN9.2 IC1.17((OC0A/OC1C/PCINT7)_PB7) IC18.15
SPI_OLED_RESET_PIN [signal cross-board]: CONN3.3 CONN6.3 CONN9.3 IC1.18((TOSC2)_PG3) IC18.14
SPI_SCK_PIN [signal cross-board]: CONN1.5 CONN4.5 CONN7.5 IC1.11((SCK/PCINT1)_PB1) IC14.SCL IC16.SCK IC17.CLK IC18.18 IC19.SCLK
SPI_SS_ADXL345_PIN [signal]: IC1.7((OC3C/INT5)_PE5) IC14.!CS! IC15.A R43.2
SPI_SS_OLED_PIN [signal cross-board]: CONN3.4 CONN6.4 CONN9.4 IC1.19((TOSC1)_PG4) IC18.13
SPI_SS_RTC_PIN [signal cross-board]: CONN1.7 CONN4.7 CONN7.7 IC1.4((XCK0/AIN0)_PE2) IC19.!CS! R55.2
SPI_SS_SD_CARD_PIN [signal]: IC1.10((~SS/PCINT0)_PB0) IC17.CD/DAT3(CS) R53.1
THERM [signal]: IC5.5(THERM) R28.1
TMP36_SHUTDOWN_PIN [signal]: IC1.51(PA0_(AD0)) IC3.4(~SHDN)
TMP36_VSENSE_PIN [signal]: IC1.61(PF0_(ADC0)) IC3.1(VOUT)
TXD [signal cross-board]: CONN2.2 CONN5.2 CONN8.2 IC7.1(TXD) R2.2
UP [signal cross-board]: C5.2 CONN3.12 CONN6.12 CONN9.12 IC6.3(2A) R12.2
USB_D+ [signal]: CONN14.DP R7.1
USB_D- [signal]: CONN14.DN R6.2
USB_RX_LED [signal]: LED3.A R4.2
USB_TX_LED [signal]: LED4.A R5.2
USBDM [signal]: IC7.9(USBDM) R6.1
USBDP [signal]: IC7.8(USBDP) R7.2
V_LIION+ [VCC]: C13.1 CONN16.1 IC5.14(VBAT) IC5.15(VBAT_2) IC5.16(VBAT_SENSE) R34.1
V_LIION_REGULATED [VCC]: C11.1 C26.2 C38.2 C42.2 CONN2.19 CONN5.19 CONN8.19 IC4.5(VIN) IC4.7(PS/SYNC) IC4.8(VINA) IC5.1(OUT_2) IC5.20(OUT) IC18.6 IC21.VBAT1 IC21.VBAT2 IC21.VRTC R51.2 S2.2 TP8.TP
VCC [VCC]: C14.1 C17.1 C18.2 C21.2 C31.1 C32.1 C34.2 C37.2 C41.1 CONN2.4 CONN3.19 CONN5.4 CONN6.19 CONN8.4 CONN9.19 CONN10.4 CONN12.6 CONN13.6 D1.C IC1.21(VCC_2) IC1.52(VCC) IC3.2(+VS) IC4.1(VOUT) IC4.10(FB) IC6.14(VCC) IC8.5(VCC) IC9.5(VCC) IC11.6(VDD) IC12.FB IC12.SEL IC12.VIN1(VCC1) IC12.VIN2(VCC2) IC14.VCC(VS) IC14.VDD(VDDIO) IC15.VCC IC16.!HOLD! IC16.!WP! IC16.VCC IC17.VDD(VCC) IC18.9 IC19.VCC IC20.VCC L1.1 LED1.A LED2.A R9.2 R11.2 R13.2 R15.2 R19.2 R20.2 R21.2 R25.1 R26.1 R29.1 R30.1 R39.1 R43.1 R44.2 R49.1 R53.2 R54.2 R55.1 R56.2 T1.2(S) TP2.TP TP4.TP
VCC_SENSE_PIN [signal]: IC1.60(PF1_(ADC1)) R25.2 R35.1
VCOMH [signal]: C12.2 IC18.27
VGPS [VCC]: C1.1 C35.1 C43.+ CONN1.8 CONN4.8 CONN7.8 IC10.VCC IC11.5(SENSE) IC12.VOUT1 IC12.VOUT2 IC19.VBACK R48.1 R60.2 TP10.TP TP11.TP
VGPS_SENSE_PIN [signal]: IC1.59(PF2_(ADC2)) R48.2 R58.1
VMID [signal]: IC12.VMID R60.1 R61.2
VPCC [signal]: IC5.2(VPCC) R23.2 R24.1
VUSB [VCC]: CONN14.VBUS L3.P$1 R4.1 R5.1
XTAL1 [signal]: C24.2 IC1.24(XTAL1) Q1.1
XTAL2 [signal]: C23.2 IC1.23(XTAL2) Q1.2
Unconnected: CONN1.10 CONN4.10 CONN7.10 CONN10.7 CONN10.8 CONN12.4 CONN12.8 CONN13.4 CONN13.8 CONN14.ID IC1.32((T0)_PD7) IC1.33(PG0_(~WR)) IC1.34(PG1_(~RD)) IC3.3(NC) IC7.2(!RTS) IC7.15(CBUS0) IC7.16(CBUS3) IC10.1PPS IC10.CTS IC10.RESET IC10.RTS IC11.4(CT) IC12.!PFO! IC12.PFI IC13.AIO0 IC13.AIO1 IC13.GPIO2 IC13.GPIO5 IC13.GPIO8 IC13.GPIO9 IC13.GPIO10 IC13.GPIO11 IC13.PCM_CLK IC13.PCM_IN IC13.PCM_OUT IC13.PCM_SYNC IC13.SPI_CLOCK IC13.SPI_CSB IC13.SPI_MISO IC13.SPI_MOSI IC13.UART_CTS IC13.UART_RTS IC13.USB_DN IC13.USB_DP IC14.INT2 IC14.NC IC14.RESERVED1(RESERVED$1) IC14.RESERVED2(RESERVED$2) IC17.DAT1 IC17.DAT2 IC18.1 IC18.7 IC18.20 IC18.30 IC20.RESERVED1 IC20.RESERVED2 IC21.ADC IC21.BT_ANT IC21.GND1 IC21.GND5 IC21.MICN IC21.MICP IC21.RF_SYNC IC21.SPKN IC21.SPKP IC21.UART1_DCD IC21.UART1_DTR IC21.UART1_RI IC21.UART1_RTS IC21.UART2_RXD IC21.UART2_TXD IC21.USB_DN IC21.USB_DP IC21.USB_VBUS IC21.VDD_EXT

## Buses
B$1
B$2
B$3
B$4
B$5
B$6
B$7
B$8
B$9
B$10

## Notes on the sheet
- Motherboard
- Reset Circuit | Oscillator Circuit | Status LEDs
- VUSB (aka. supercap voltage)  measurement | AVCC Circuit
- Voltage Reference | Vcc Measurement | Temperature Sensor
- Buzzer
- Power Supply - Buck/Boost Regulator | Power Supply - Power Path Controller
- Joystick | Buttons
- Schmitt Trigger
- USB to Serial | USB connetor
- Analog Switch
- VGPS Voltage Supervisor
- GPS module | Supercap Charger
- Bluetooth Module
- SPI Bus
- ADXL345 Accelerometer | FERAM Module | SD Card Slot
- OLED
- RTC Clock
- ER-OLED015-2W Connetor w. SSD1309
- SIM800C
- SIM Card Holder | SIM800C GPRS Module

## Power pins joined to a net without a drawn wire
PFI_RET: IC12.PFI_RET

## Library data of the parts
C1-C5 C7-C11 C13-C15 C22-C24 C29 C30 C33 = resistor:C-EU: CAPACITOR, European symbol
C6 C12 C16-C18 C21 C25-C28 C31 C32 C34-C42 = rcl:C-EU: CAPACITOR, European symbol
C43 = EECS5R5H155 Supercap:EECS5R5H155
C44-C47 C49 = rcl:CPOL-EU: POLARIZED CAPACITOR, European symbol
CONN1 CONN4 CONN7 = con-lstb:MA10-1: PIN HEADER; OC_FARNELL: unknown; OC_NEWARK: unknown
CONN2 CONN3 CONN5 CONN6 CONN8 CONN9 = con-lsta:FE20-1: FEMALE HEADER; OC_FARNELL: unknown; OC_NEWARK: unknown
CONN10 CONN12 CONN13 = 1.27mm 10pin header:1.27-10-PIN-HEADER
CONN11 = jumper:JP1E: JUMPER
CONN14 = MX500075-1517 USB Mini-B straight socket:MX500075-1517USB_MINI-B
CONN15 = discrete:ANTENNA: Antenna
CONN16 = SIM800C:JST_2PIN: JST 2-Pin Connectors of various flavors SMT-RA (S2B-PH-SM4) 4UConnector #17311 SMT (B2B-PH-SM4) THM-RA (S2B-PH) THM (B2B-PH)
D1 = Diode2:1N4148: DIODE high speed (Philips)
D2 = eagle-ltspice:SCHOTTKY-DIODE: Schottky Diode; SPICEMODEL: NONE; SPICEPREFIX: D; SPICETYPE: diode
FI1 FI2 = adafruit:FIDUCIAL: For use by pick and place machines to calibrate the vision/machine, 1mm By microbuilder.eu
IC1 = Atmel_By_element14_Batch_1-00:ATMEGA1281-16AU: Microcontroller; DESCRIPTION: Microcontroller; MPN: ATMEGA1281-16AU; OC_FARNELL: 1455092; OC_NEWARK: 58M3721; PACKAGE: QFP-64; SUPPLIER: ATMEL
IC2 = microchip:MC15*: 2.5V and 4.096V Voltage References Source: http://www.microchip.com .. 21653b.pdf; OC_FARNELL: unknown; OC_NEWARK: unknown
IC3 = TMP36GRTZ:TMP36GRTZ-REEL7: Low Voltage Temperature Sensors; MPN: TMP36GRTZ-REEL7; OC_FARNELL: 1661084; OC_NEWARK: 96K2116; PACKAGE: SOT23-5; SUPPLIER: Analog Devices
IC4 = TI TPS63031:TPS63001DRCR
IC5 = Microchip-MCP73871-2AAI_ML:MCP73871-2AAI/ML: IC, BATTERY CHARGER, 1A; MPN: MCP73871-2AAI/ML; OC_FARNELL: 1642487; OC_NEWARK: 54M4955; PACKAGE: QFN-20; SUPPLIER: Microchip
IC6 = Texas Instruments_By_element14_Batch_1:SN74HCT14DR: Hex Inverting Schmitt Trigger Inverters; MPN: SN74HCT14DR; OC_FARNELL: 1387913; OC_NEWARK: 67K2834; PACKAGE: SOIC-14; SUPPLIER: Texas Instruments
IC7 = ftdichip:FT230X: USB to BASIC UART IC Auto generated by make-symbol-device-package-bsdl.ulp Rev. 43 Source: Data sheet <http://www.ftdichip.com/Support/Documents/DataSheets/ICs/DS_FT230X.pdf>
IC8 IC9 = Texas Instruments_By_element14_Batch_1:SN74LVC1G3157DBVR: SINGLE-POLE, DOUBLE-THROW ANALOG SWITCH; MPN: SN74LVC1G3157DBVR; OC_FARNELL: 1470910; OC_NEWARK: 32H6364; PACKAGE: SOT-23-6; SUPPLIER: Texas Instruments
IC10 = ORG1510-MK4 GPS module:ORG1510-MK4
IC11 = Texas Instruments_By_element14_Batch_1:TPS3808G33DBVT: Low Quiescent Current, Programmable-Delay Supervisory Circuit; MPN: TPS3808G33DBVT; OC_FARNELL: 1755534; OC_NEWARK: 21J9211; PACKAGE: SOT-23-6; SUPPLIER: Texas Instruments
IC12 = LTC4425 Supercap Charger:LTC4425: The ISL85003 and ISL85003A are synchronous buck regulators with integrated high-side and low-side FET’s. The regulator can operate from an input voltage range of 4.5V to 18V while delivering a very efficient continuous 3A current. This is all delivered in a very compact 3x4mm DFN package. More about it you can find at ISL85003 <http://www.intersil.com/en/products/power-management/switching-regulators/integrated-fet-regulators/ISL85003.html> The library has been designed by Richard Magdycz <https://www.facebook.com/groups/eaglecadsoftUK>
IC13 = EN42-I Bluetooth Module:RN-42
IC14 = ADXL345 Accelerometer:ADXL345: 3-Axis, ±2 g/±4 g/±8 g/±16 g Digital Accelerometer
IC15 = 74HCT1G32GW:74HCT1G32GW: Two Input OR gate
IC16 = FM25W256 FERAM:FM25W256: FeRAM Module; OC_FARNELL: unknown; OC_NEWARK: unknown
IC17 = Molex SD-47309 SD Card Slot:MICROSD_SPI_MODE: MOLEX - 49225-0821 - CONNECTEUR MICRO SD PUSH/PUSH REV Fabricant: MOLEX Code commande Farnell: 1366700 <http://fr.farnell.com/molex/49225-0821/connecteur-micro-sd-push-push-rev/dp/1366700?Ntt=1366700> Référence fabricant: 49225-0821
IC18 = con-hirose:FH12-30S-0.5S: 0.5mm Pitch Connectors For FPC/FFC Source: Data sheet <http://www.hirose.co.jp/cataloge_hp/e58605370.pdf>; MPN: FH12-30S-0.5SH(55); OC_FARNELL: 1324555; OC_NEWARK: 34M6176
IC19 = DS1394U-33+ RTC SPI Module:DS1394U-33+
IC20 = 115Q-BCA0 Micro-SIM Socket:115Q-BCA0
IC21 = SIM800 GPRS Module:SIM800
JP2 JP3 = jumper:SJ: SMD solder JUMPER
L1 = rcl:L-US: INDUCTOR, American symbol
L2 = DJNR3015-1R5 Inductor:DJNR3015-1R5
L3 = DJNR6045-100S Power Inductor:DJNR6045-100-S: Shielded Power Inductors Package 6.6 × 6.6 mm x 4.1 mm high Source: http://www.farnell.com/datasheets/1681958.pdf
LED1-LED6 = led:LED: LED OSRAM: - CHIPLED LG R971, LG N971, LY N971, LG Q971, LY Q971, LO R971, LY R971 LH N974, LH R974 LS Q976, LO Q976, LY Q976 LO Q996 - Hyper CHIPLED LW Q18S LB Q993, LB Q99A, LB R99A - SideLED LS A670, LO A670, LY A670, LG A670, LP A670 LB A673, LV A673, LT A673, LW A673 LH A674 LY A675 LS A676, LA A676, LO A676, LY A676, LW A676 LS A679, LY A679, LG A679 - Hyper Micro SIDELED® LS Y876, LA Y876, LO Y876, LY Y876 LT Y87S - SmartLED LW L88C, LW L88S LB L89C, LB L89S, LG L890 LS L89K, LO L89K, LY L89K LS L896, LA L896, LO L896, LY L896 - TOPLED LS T670, LO T670, LY T670, LG T670, LP T670 LSG T670, LSP T670, LSY T670, LOP T670, LYG T670 LG T671, LOG T671, LSG T671 LB T673, LV T673, LT T673, LW T673 LH T674 LS T676, LA T676, LO T676, LY T676, LB T676, LH T676, LSB T676, LW T676 LB T67C, LV T67C, LT T67C, LS T67K, LO T67K, LY T67K, LW E67C LS E67B, LA E67B, LO E67B, LY E67B, LB E67C, LV E67C, LT E67C LW T67C LS T679, LY T679, LG T679 LS T770, LO T770, LY T770, LG T770, LP T770 LB T773, LV T773, LT T773, LW T773 LH T774 LS E675, LA E675, LY E675, LS T675 LS T776, LA T776, LO T776, LY T776, LB T776 LHGB T686 LT T68C, LB T68C - Hyper Mini TOPLED® LB M676 - Mini TOPLED Santana® LG M470 LS M47K, LO M47K, LY M47K Source: http://www.osram.convergy.de LUXEON: - LUMILED® LXK2-PW12-R00, LXK2-PW12-S00, LXK2-PW14-U00, LXK2-PW14-V00 LXK2-PM12-R00, LXK2-PM12-S00, LXK2-PM14-U00 LXK2-PE12-Q00, LXK2-PE12-R00, LXK2-PE12-S00, LXK2-PE14-T00, LXK2-PE14-U00 LXK2-PB12-K00, LXK2-PB12-L00, LXK2-PB12-M00, LXK2-PB14-N00, LXK2-PB14-P00, LXK2-PB14-Q00 LXK2-PR12-L00, LXK2-PR12-M00, LXK2-PR14-Q00, LXK2-PR14-R00 LXK2-PD12-Q00, LXK2-PD12-R00, LXK2-PD12-S00 LXK2-PH12-R00, LXK2-PH12-S00 LXK2-PL12-P00, LXK2-PL12-Q00, LXK2-PL12-R00 Source: www.luxeon.com KINGBRIGHT: KA-3528ASYC Source: www.kingbright.com
Q1 = special:OSCILATOR
Q2 = LFXTAL016178R 32.768kHz crystal:LFXTAL016178R
R1-R3 R8-R14 R16-R35 R42-R47 R49 R52-R55 R57 = rcl:R-EU_: RESISTOR, European symbol
R4-R7 R15 R36 R39-R41 R48 R50 R51 R56 R58-R61 = resistor:R-EU_: RESISTOR, European symbol
S1 = DTSM-32N-B:DTSM-32N-B: OMRON SWITCH; MPN: B3F-1000; OC_FARNELL: 176432; OC_NEWARK: 36M3542
S2 = smd-special:SWS001: SMD Dip Switch 1 pol.
S3 = micro joystick:MICROJOYSTICK
S4 S5 = switch-omron:10-XX: OMRON SWITCH; MPN: B3F-1000; OC_FARNELL: 176432; OC_NEWARK: 36M3542
T1 = transistor-small-signal:BSS84: P-CHANNEL MOS FET
TP1 = testpad:TP: Test pad
TP2-TP11 = testpad:PTR1: TEST PIN
U$1 = buzzer:F/UCW03F

## Module BOARD2BOARD
Ports: GND(io) VCC(io)

### Library data of the parts

## Net classes
0 GND: width 0.4 mm, drill 0.25 mm, clearance 0.1 mm
1 VCC: width 0.3 mm, drill 0.25 mm, clearance 0.1 mm to class 0, clearance 0.1 mm
2 signal: width 0.25 mm, drill 0.25 mm, clearance 0.1 mm to class 0, clearance 0.1 mm to class 1, clearance 0.1 mm
3 signal cross-board: width 0.25 mm, drill 0.25 mm, clearance 0.1 mm to class 0, clearance 0.1 mm to class 1, clearance 0.1 mm to class 2, clearance 0.1 mm